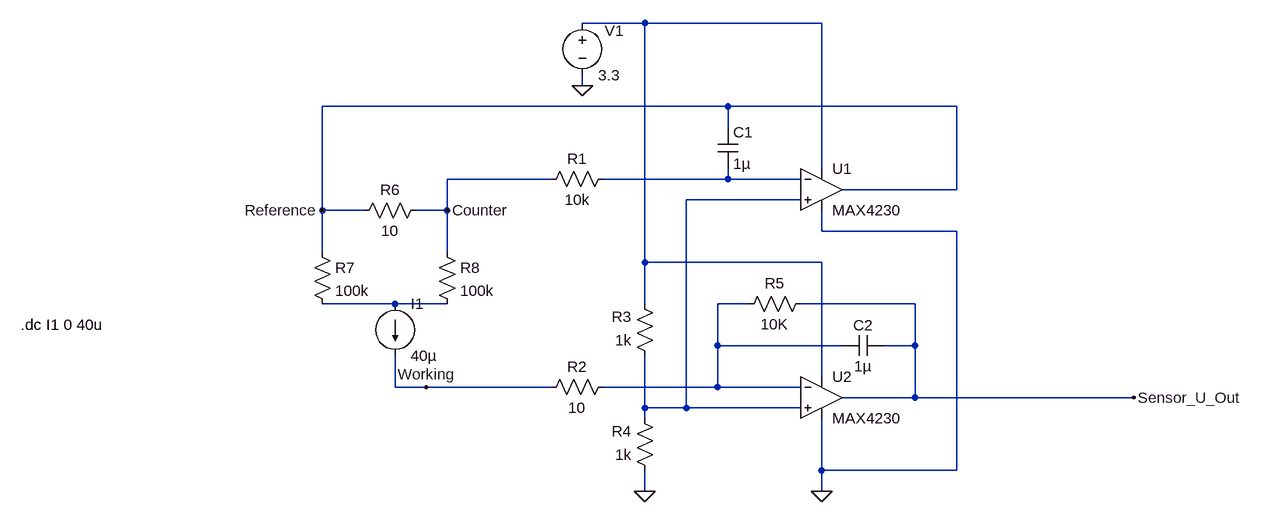
[diagram p0: schematic Sensor_Signal.asc]
Sensor_Signal.asc, the LTspice schematic file:
Version 4
SHEET 1 880 680
WIRE -112 -448 -208 -448
WIRE 160 -448 -112 -448
WIRE -208 -352 -208 -368
WIRE 16 -320 -608 -320
WIRE 368 -320 16 -320
WIRE 16 -288 16 -320
WIRE 160 -224 160 -448
WIRE -256 -208 -416 -208
WIRE 16 -208 16 -224
WIRE 16 -208 -176 -208
WIRE 128 -208 16 -208
WIRE 368 -192 368 -320
WIRE 368 -192 192 -192
WIRE 128 -176 -48 -176
WIRE -608 -160 -608 -320
WIRE -544 -160 -608 -160
WIRE -416 -160 -416 -208
WIRE -416 -160 -464 -160
WIRE 160 -128 160 -160
WIRE 368 -128 160 -128
WIRE -608 -96 -608 -160
WIRE -416 -96 -416 -160
WIRE -112 -80 -112 -448
WIRE 160 -80 -112 -80
WIRE -496 -16 -608 -16
WIRE -416 -16 -496 -16
WIRE -112 -16 -112 -80
WIRE 48 -16 0 -16
WIRE 304 -16 128 -16
WIRE 0 48 0 -16
WIRE 192 48 0 48
WIRE 304 48 304 -16
WIRE 304 48 256 48
WIRE 160 96 160 -80
WIRE -496 112 -496 64
WIRE -448 112 -496 112
WIRE -256 112 -448 112
WIRE 0 112 0 48
WIRE 0 112 -176 112
WIRE 128 112 0 112
WIRE 304 128 304 48
WIRE 304 128 192 128
WIRE 640 128 304 128
WIRE -112 144 -112 64
WIRE -48 144 -48 -176
WIRE -48 144 -112 144
WIRE 128 144 -48 144
WIRE -112 160 -112 144
WIRE 160 240 160 160
WIRE 368 240 368 -128
WIRE 368 240 160 240
WIRE -112 272 -112 240
WIRE 160 272 160 240
FLAG 160 272 0
FLAG 640 128 Sensor_U_Out
FLAG -208 -352 0
FLAG -112 272 0
FLAG -608 -160 Reference
FLAG -448 112 Working
FLAG -416 -160 Counter
SYMBOL voltage -208 -464 R0
WINDOW 123 0 0 Left 0
WINDOW 39 0 0 Left 0
WINDOW 0 34 28 Left 2
SYMATTR InstName V1
SYMATTR Value 3.3
SYMBOL res -160 -224 R90
WINDOW 0 0 56 VBottom 2
WINDOW 3 32 56 VTop 2
SYMATTR InstName R1
SYMATTR Value 10k
SYMBOL cap 0 -288 R0
SYMATTR InstName C1
SYMATTR Value 1µ
SYMBOL res -160 96 R90
WINDOW 0 0 56 VBottom 2
WINDOW 3 32 56 VTop 2
SYMATTR InstName R2
SYMATTR Value 10
SYMBOL res -96 80 R180
WINDOW 0 36 76 Left 2
WINDOW 3 36 40 Left 2
SYMATTR InstName R3
SYMATTR Value 1k
SYMBOL res -96 256 R180
WINDOW 0 36 76 Left 2
WINDOW 3 36 40 Left 2
SYMATTR InstName R4
SYMATTR Value 1k
SYMBOL res 144 -32 R90
WINDOW 0 0 56 VBottom 2
WINDOW 3 32 56 VTop 2
SYMATTR InstName R5
SYMATTR Value 10K
SYMBOL cap 256 32 R90
WINDOW 0 0 32 VBottom 2
WINDOW 3 32 32 VTop 2
SYMATTR InstName C2
SYMATTR Value 1µ
SYMBOL OpAmps\\MAX4230 160 -256 R0
SYMATTR InstName U1
SYMBOL OpAmps\\MAX4230 160 64 R0
SYMATTR InstName U2
SYMBOL res -448 -176 R90
WINDOW 0 0 56 VBottom 2
WINDOW 3 32 56 VTop 2
SYMATTR InstName R6
SYMATTR Value 10
SYMBOL res -624 -112 R0
SYMATTR InstName R7
SYMATTR Value 100k
SYMBOL res -432 -112 R0
SYMATTR InstName R8
SYMATTR Value 100k
SYMBOL current -496 -16 R0
WINDOW 123 0 0 Left 0
WINDOW 39 0 0 Left 0
SYMATTR InstName I1
SYMATTR Value 40µ
TEXT -1072 16 Left 2 !.dc I1 0 40u

The netlist it stands for:
* Sensor_Signal.asc
V1 N001 0 3.3
R1 N002 Counter 10k
C1 Reference N002 1µ
R2 N005 Working 10
R3 N003 N001 1k
R4 0 N003 1k
R5 Sensor_U_Out N005 10K
C2 Sensor_U_Out N005 1µ
XU1 N003 N002 N001 0 Reference MAX4230  ; pins In+ In- V+ V- OUT
XU2 N003 N005 N001 0 Sensor_U_Out MAX4230  ; pins In+ In- V+ V- OUT
R6 Counter Reference 10
R7 Reference N004 100k
R8 Counter N004 100k
I1 N004 Working 40µ
.dc I1 0 40u
.lib MAX4230.lib
.backanno
.end